# EAGLE design shield puissance (EAGLE 7.5.0)
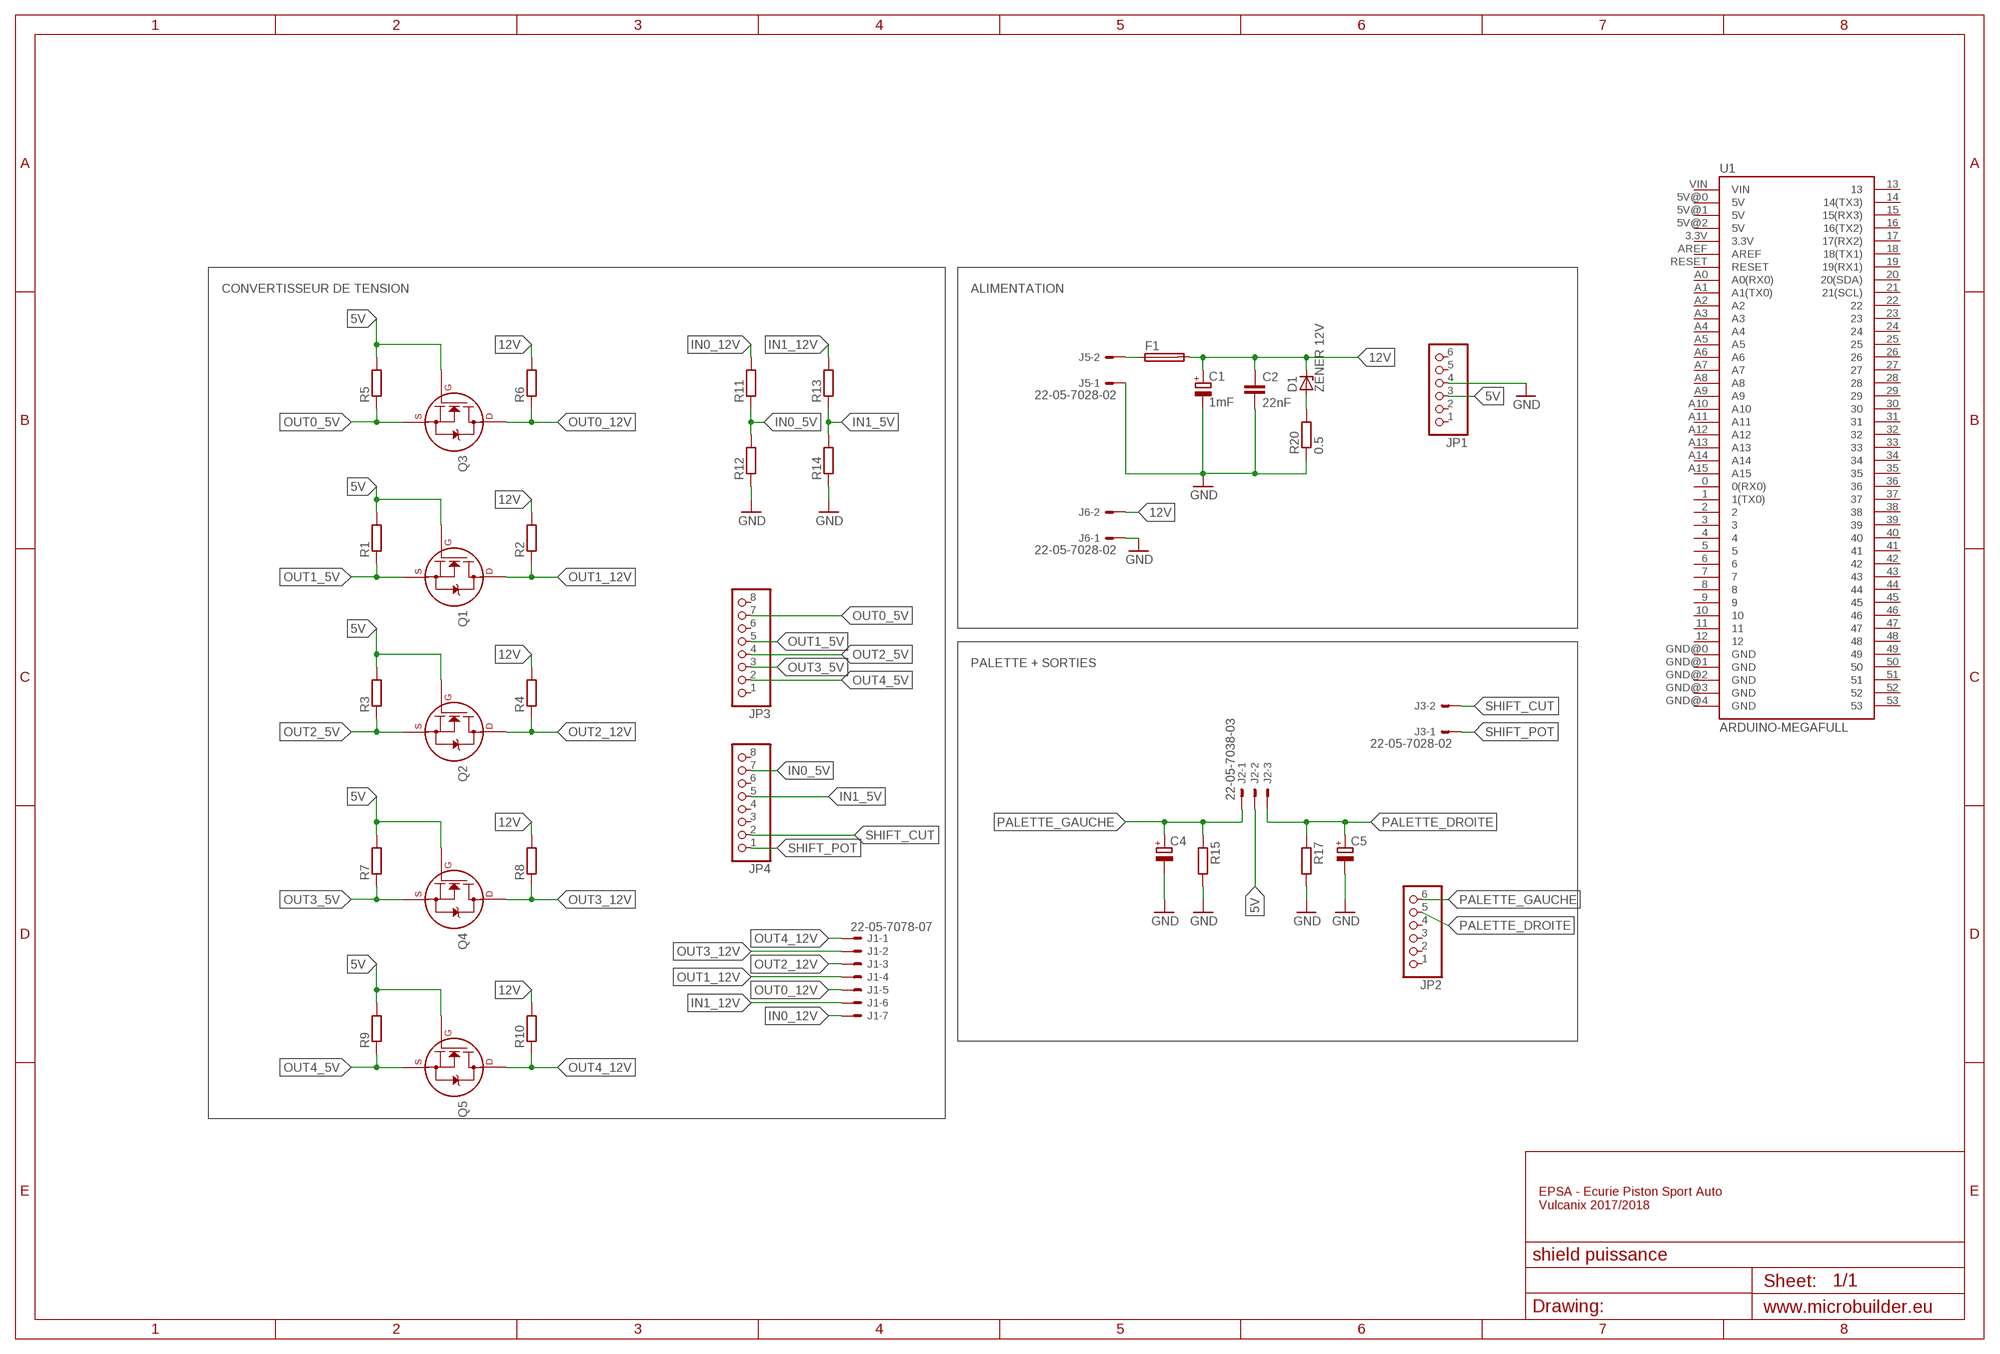
[diagram p0: schematic, sheet 1]

## Parts
C1  1mF  CPOL-EUE2,5-6E  [E2,5-6E]
C2  22nF  C-EU025-025X050  [C025-025X050]
C4  CPOL-EUE2,5-6E  [E2,5-6E]
C5  CPOL-EUE2,5-6E  [E2,5-6E]
D1  ZENER 12V  ZENER-DIODEDO41Z10  [DO41Z10]
F1  SH25  [SH25]
J1  22-05-7078-07  [7395-07]
J2  22-05-7038-03  [7395-03]
J3  22-05-7028-02  [7395-02]
J5  22-05-7028-02  [7395-02]
J6  22-05-7028-02  [7395-02]
JP1  HEADER-1X6  [1X06_OVAL]
JP2  HEADER-1X6  [1X06_OVAL]
JP3  HEADER-1X8  [1X08_OVAL]
JP4  HEADER-1X8  [1X08_OVAL]
Q1  2N7000_TO92  [TO-92]
Q2  2N7000_TO92  [TO-92]
Q3  2N7000_TO92  [TO-92]
Q4  2N7000_TO92  [TO-92]
Q5  2N7000_TO92  [TO-92]
R1  R-EU_0204/7  [0204/7]
R2  R-EU_0204/7  [0204/7]
R3  R-EU_0204/7  [0204/7]
R4  R-EU_0204/7  [0204/7]
R5  R-EU_0204/7  [0204/7]
R6  R-EU_0204/7  [0204/7]
R7  R-EU_0204/7  [0204/7]
R8  R-EU_0204/7  [0204/7]
R9  R-EU_0204/7  [0204/7]
R10  R-EU_0204/7  [0204/7]
R11  R-EU_0204/7  [0204/7]
R12  R-EU_0204/7  [0204/7]
R13  R-EU_0204/7  [0204/7]
R14  R-EU_0204/7  [0204/7]
R15  R-EU_0204/7  [0204/7]
R17  R-EU_0204/7  [0204/7]
R20  0.5  R-EU_0309/12  [0309/12]
U1  ARDUINO-MEGAFULL  [ARDUINO_MEGA]

## Nets
5V: J2.2 JP1.3 Q1.2(G) Q2.2(G) Q3.2(G) Q4.2(G) Q5.2(G) R1.2 R3.2 R5.2 R7.2 R9.2
12V: C1.+ C2.1 D1.C F1.2 J6.2 R2.2 R4.2 R6.2 R8.2 R10.2
GND: C1.- C2.2 C4.- C5.- J5.1 J6.1 JP1.4 R12.1 R14.1 R15.2 R17.2 R20.1
IN0_5V: JP4.7 R11.1 R12.2
IN0_12V: J1.7 R11.2
IN1_5V: JP4.5 R13.1 R14.2
IN1_12V: J1.6 R13.2
N$1: F1.1 J5.2
N$4: D1.A R20.2
OUT0_5V: JP3.7 Q3.1(S) R5.1
OUT0_12V: J1.5 Q3.3(D) R6.1
OUT1_5V: JP3.5 Q1.1(S) R1.1
OUT1_12V: J1.4 Q1.3(D) R2.1
OUT2_5V: JP3.4 Q2.1(S) R3.1
OUT2_12V: J1.3 Q2.3(D) R4.1
OUT3_5V: JP3.3 Q4.1(S) R7.1
OUT3_12V: J1.2 Q4.3(D) R8.1
OUT4_5V: JP3.2 Q5.1(S) R9.1
OUT4_12V: J1.1 Q5.3(D) R10.1
PALETTE_DROITE: C5.+ J2.3 JP2.5 R17.1
PALETTE_GAUCHE: C4.+ J2.1 JP2.6 R15.1
SHIFT_CUT: J3.2 JP4.2
SHIFT_POT: J3.1 JP4.1
Unconnected: JP1.1 JP1.2 JP1.5 JP1.6 JP2.1 JP2.2 JP2.3 JP2.4 JP3.1 JP3.6 JP3.8 JP4.3 JP4.4 JP4.6 JP4.8 U1.0(0(RX0)) U1.1(1(TX0)) U1.2 U1.3 U1.3.3V U1.4 U1.5 U1.5V@0(5V) U1.5V@1(5V) U1.5V@2(5V) U1.6 U1.7 U1.8 U1.9 U1.10 U1.11 U1.12 U1.13 U1.14(14(TX3)) U1.15(15(RX3)) U1.16(16(TX2)) U1.17(17(RX2)) U1.18(18(TX1)) U1.19(19(RX1)) U1.20(20(SDA)) U1.21(21(SCL)) U1.22 U1.23 U1.24 U1.25 U1.26 U1.27 U1.28 U1.29 U1.30 U1.31 U1.32 U1.33 U1.34 U1.35 U1.36 U1.37 U1.38 U1.39 U1.40 U1.41 U1.42 U1.43 U1.44 U1.45 U1.46 U1.47 U1.48 U1.49 U1.50 U1.51 U1.52 U1.53 U1.A0(A0(RX0)) U1.A1(A1(TX0)) U1.A2 U1.A3 U1.A4 U1.A5 U1.A6 U1.A7 U1.A8 U1.A9 U1.A10 U1.A11 U1.A12 U1.A13 U1.A14 U1.A15 U1.AREF U1.GND@0(GND) U1.GND@1(GND) U1.GND@2(GND) U1.GND@3(GND) U1.GND@4(GND) U1.RESET U1.VIN

## Notes on the sheet
- CONVERTISSEUR DE TENSION | ALIMENTATION
- PALETTE + SORTIES
- EPSA - Ecurie Piston Sport Auto
  Vulcanix 2017/2018

## Library data of the parts
C1 C4 C5 = rcl:CPOL-EU: POLARIZED CAPACITOR, European symbol
C2 = rcl:C-EU: CAPACITOR, European symbol
D1 = diode:ZENER-DIODE: Z-Diode
F1 = fuse:SH25: FUSE HOLDER grid 25 mm, OGN0031 8211, Schurter (Buerklin); MF: SCHURTER; MPN: 0031.8211; OC_FARNELL: 1162741; OC_NEWARK: 96B9380
J1 = EP_molex_6410_7395:22-?-07: CONNECTOR wire to board 2.54 mm (.1 inch) pitch header
J2 = EP_molex_6410_7395:22-?-03: CONNECTOR wire to board 2.54 mm (.1 inch) pitch header
J3 J5 J6 = EP_molex_6410_7395:22-?-02: CONNECTOR wire to board 2.54 mm (.1 inch) pitch header
JP1 JP2 = microbuilder:HEADER-1X6: PIN HEADER
JP3 JP4 = microbuilder:HEADER-1X8: PIN HEADER
Q1-Q5 = transistors:2N700*: 2N7000, 2N7002, NDS7002A N-channel enhancement mode MOSFET
R1-R15 R17 R20 = resistor:R-EU_: RESISTOR, European symbol
U1 = SparkFun-Boards:ARDUINO-MEGA: Arduino Mega board footprint

## Board
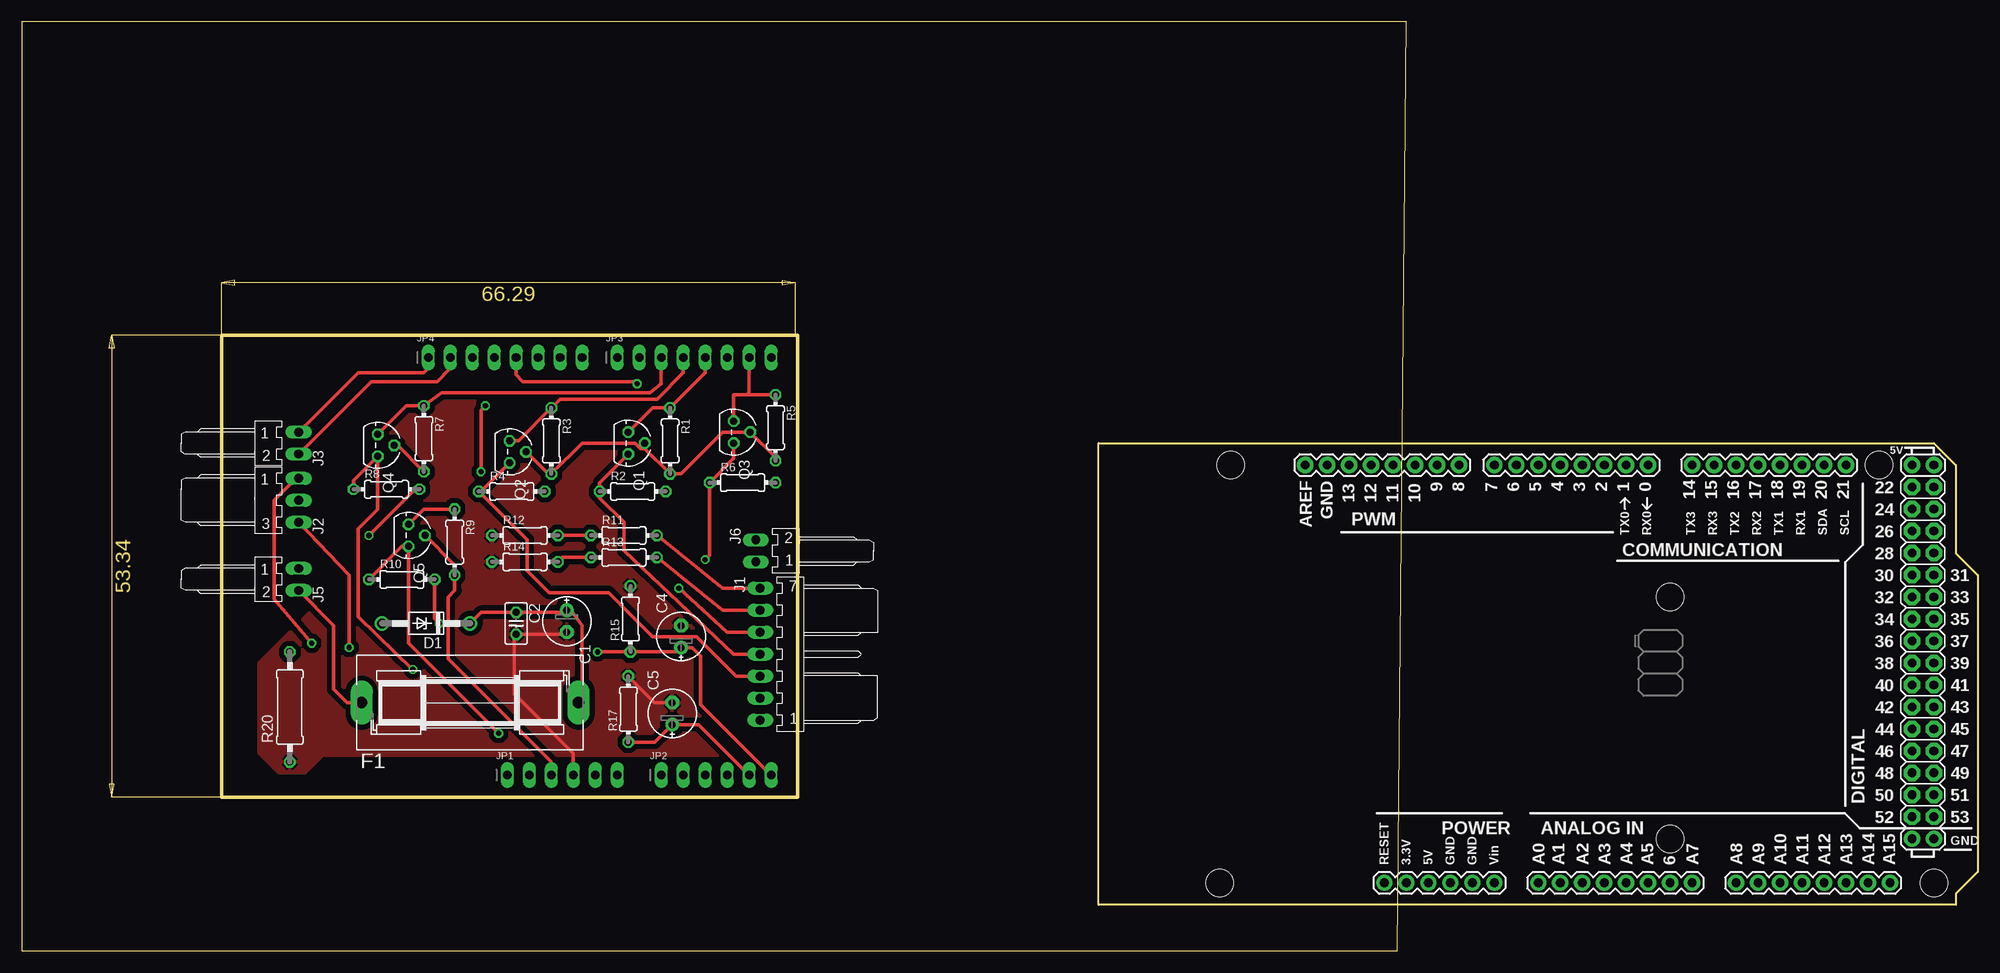
[diagram p1: board, top side]
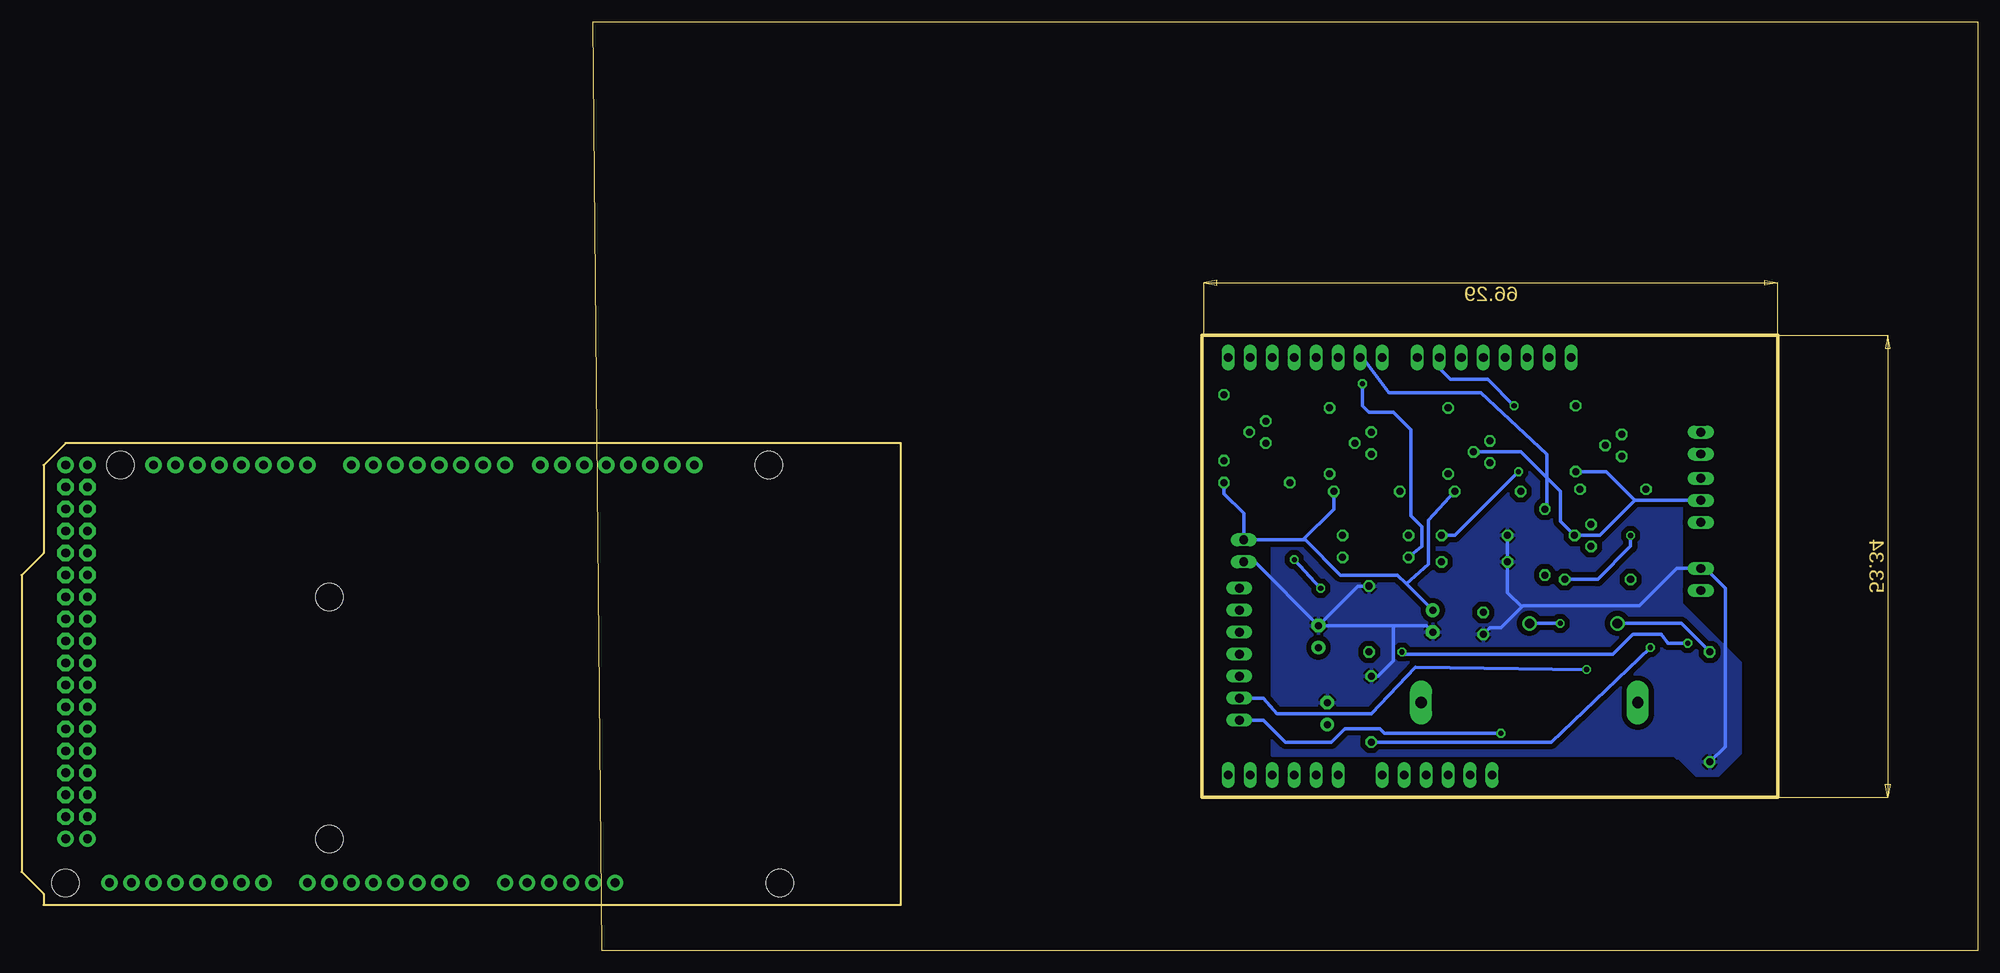
[diagram p2: board, bottom side, seen from below]

Size 160 x 107.37 mm. Coordinates in mm from the lower left corner, seen from the top.
Outline: 0,0 158.98,0 160,107.37 0,107.37 0,0
Outline: 23.11,71.12 23.11,17.78 89.66,17.78 89.66,71.12 23.11,71.12
Copper layers (1*16): Top 0.035mm / dielectric 1.5mm / Bottom 0.035mm
Design rules "default *": minimum track width 10mil, minimum drill 24mil, track to track 10mil, track to pad 10mil, pad to pad 10mil, via to via 10mil, smd to smd 8mil, copper to edge 40mil, drill to drill 8mil, minimum pad ring 10mil, minimum via ring 8mil, stop-mask expansion 4mil, vias tented up to drill 0mil, thermal gap 10mil

### Footprints (pad centres in the part's own frame; a part is rotated, then mirrored left to right if it is on the bottom)
E2,5-6E = drill 0.813 pad 1.575: + -1.27,0 | drill 0.813 pad 1.575 octagon: - 1.27,0
C025-025X050 = drill 0.813 octagon: 1 -1.27,0; 2 1.27,0
DO41Z10 = drill 1.118: A 5.08,0; C -5.08,0
SH25 = drill 1.321 pad 2.54 long: 1 -12.522,0; 2 12.522,0
7395-07 = drill 1.016 long: 1 7.62,0; 2 5.08,0; 3 2.54,0; 4 0,0; 5 -2.54,0; 6 -5.08,0; 7 -7.62,0
7395-03 = drill 1.016 long: 1 2.54,0; 2 0,0; 3 -2.54,0
7395-02 = drill 1.016 long: 1 1.27,0; 2 -1.27,0
1X06_OVAL = drill 1 long: 1 -6.35,0; 2 -3.81,0; 3 -1.27,0; 4 1.27,0; 5 3.81,0; 6 6.35,0
1X08_OVAL = drill 1 long: 1 -8.89,0; 2 -6.35,0; 3 -3.81,0; 4 -1.27,0; 5 1.27,0; 6 3.81,0; 7 6.35,0; 8 8.89,0
TO-92 = drill 0.813 octagon: 1 -1.27,0; 2 0,1.905; 3 1.27,0
0204/7 = drill 0.813 octagon: 1 -3.81,0; 2 3.81,0
0309/12 = drill 0.813 octagon: 1 -6.35,0; 2 6.35,0
ARDUINO_MEGA = drill 1.016 pad 1.88: 0 63.5,50.8; 1 60.96,50.8; 2 58.42,50.8; 3 55.88,50.8; 3.3V 35.56,2.54; 4 53.34,50.8; 5 50.8,50.8; 5V@0 38.1,2.54; 5V@1 93.98,50.8; 5V@2 96.52,50.8; 6 48.26,50.8; 7 45.72,50.8; 8 41.656,50.8; 9 39.116,50.8; 10 36.576,50.8; 11 34.036,50.8; 12 31.496,50.8; 13 28.956,50.8; 14 68.58,50.8; 15 71.12,50.8; 16 73.66,50.8; 17 76.2,50.8; 18 78.74,50.8; 19 81.28,50.8; 20 83.82,50.8; 21 86.36,50.8; A0 50.8,2.54; A1 53.34,2.54; A2 55.88,2.54; A3 58.42,2.54; A4 60.96,2.54; A5 63.5,2.54; A6 66.04,2.54; A7 68.58,2.54; A8 73.66,2.54; A9 76.2,2.54; A10 78.74,2.54; A11 81.28,2.54; A12 83.82,2.54; A13 86.36,2.54; A14 88.9,2.54; A15 91.44,2.54; AREF 23.876,50.8; GND@0 40.64,2.54; GND@1 43.18,2.54; GND@2 93.98,7.62; GND@3 96.52,7.62; GND@4 26.416,50.8; RESET 33.02,2.54; VIN 45.72,2.54 | drill 1.016 pad 1.88 octagon: 22 93.98,48.26; 23 96.52,48.26; 24 93.98,45.72; 25 96.52,45.72; 26 93.98,43.18; 27 96.52,43.18; 28 93.98,40.64; 29 96.52,40.64; 30 93.98,38.1; 31 96.52,38.1; 32 93.98,35.56; 33 96.52,35.56; 34 93.98,33.02; 35 96.52,33.02; 36 93.98,30.48; 37 96.52,30.48; 38 93.98,27.94; 39 96.52,27.94; 40 93.98,25.4; 41 96.52,25.4; 42 93.98,22.86; 43 96.52,22.86; 44 93.98,20.32; 45 96.52,20.32; 46 93.98,17.78; 47 96.52,17.78; 48 93.98,15.24; 49 96.52,15.24; 50 93.98,12.7; 51 96.52,12.7; 52 93.98,10.16; 53 96.52,10.16 | hole 3.2: 15.24,50.8; 13.97,2.54; 66.04,35.56; 66.04,7.62; 90.17,50.8; 96.52,2.54

### Placement (x,y rotation side)
C1  62.99,38.1 270 top
C2  57.15,37.85 270 top
C4  76.2,36.32 90 top
C5  75.18,27.43 90 top
D1  46.74,37.85 180 top
F1  51.82,28.7 0 top
J1  85.34,34.29 270 top
J2  32,52.07 90 top
J3  32,58.67 90 top
J5  32,42.93 90 top
J6  84.84,46.23 270 top
JP1  62.48,20.32 0 top
JP2  80.26,20.32 0 top
JP3  77.72,68.58 0 top
JP4  55.88,68.58 0 top
Q1  70.1,58.67 270 top
Q2  56.39,57.66 270 top
Q3  82.3,59.94 270 top
Q4  41.15,58.42 270 top
Q5  44.7,48.01 270 top
R1  74.93,58.93 270 top
R2  70.61,53.09 0 top
R3  61.21,58.93 270 top
R4  56.64,53.09 0 top
R5  87.12,60.45 270 top
R6  83.31,54.1 0 top
R7  46.48,59.18 270 top
R8  42.16,53.34 0 top
R9  50.04,47.24 270 top
R10  43.94,42.93 0 top
R11  69.6,48.01 0 top
R12  58.17,48.01 0 top
R13  69.6,45.47 0 top
R14  58.17,44.96 0 top
R15  70.36,38.35 90 top
R17  70.1,27.94 90 top
R20  30.99,28.19 90 top
U1  124.46,5.33 0 top

### Tracks (layer width: path | path; a pad name or v marks a point on that pad's centre or on a via)
5V
  Top 0.406: R7.2 43.43,58.42 Q4.2 | Q2.2 60.83,55.12 R3.2 64.77,58.67 70.87,58.67 71.5,58.04 72.01,58.04 | 72.01,58.04 R1.2 76.2,55.12 81.03,59.94 Q3.2 87.12,57.02 R5.2 | 72.01,58.04 Q1.2 | Q5.2 50.04,44.58 R9.2 50.04,41.66 49.28,40.89 49.28,33.78 61.21,21.84 JP1.3
  Bottom 0.406: J2.2 39.62,52.07 | 39.62,52.07 43.69,48.01 Q5.2 48.26,49.66 48.26,53.09 52.83,57.66 Q2.2 | 39.62,52.07 42.93,55.37 R7.2
12V  (via drill 0.6)
  Top 0.406: F1.2 64.77,29.64 64.77,37.59 63.5,39.37 C1.+ 62.74,39.12 C2.1 53.09,39.12 D1.C | R10.2 47.75,38.35 v48.26,37.85 | R8.2 45.47,53.34 v40.13,48.01
  Bottom 0.406: 77.98,47.5 J6.2 84.84,50.55 87.12,52.83 R6.2 | 77.98,47.5 77.72,47.5 73.66,43.43 67.06,43.43 66.04,42.42 | 66.04,42.42 C1.+ | v48.26,37.85 D1.C | R4.2 63.5,49.78 63.5,44.7 66.04,42.42 | R2.2 74.42,51.05 77.98,47.5 | v40.13,48.01 40.13,46.74 43.94,42.93 R10.2
GND
  Top 0.406: JP1.4 63.75,22.86 56.9,29.72 56.9,36.32 C2.2 62.74,36.58 C1.- | C5.- 73.15,28.7 R17.2
  Bottom 0.406: R20.1 29.21,23.62 29.21,41.91 31.5,44.2 J5.1 34.8,44.2 39.12,39.88 52.58,39.88 52.7,39.75 | 52.7,39.75 55.12,37.34 56.39,37.34 C2.2 | 52.7,39.75 54.36,41.4 R14.1 R12.1 | R15.2 71.63,42.16 C4.- | C4.- 67.56,37.59 | 67.56,37.59 63.75,37.59 C1.- | J6.1 83.57,44.96 C4.- | R17.2 69.34,31.75 67.56,33.53 67.56,37.59
  pour Top (isolate 0.61): 31.5,61.47 36.58,66.55 87.38,66.55 88.39,65.53 88.39,52.58 85.09,49.28 83.57,49.28 81.79,47.5 81.79,22.61 34.8,22.61 32.77,20.57 29.72,20.57 27.43,22.86 27.43,33.27 34.29,40.13 34.29,60.71 33.53,61.47
  pour Bottom (isolate 0.61): 36.58,66.55 87.38,66.55 88.39,65.53 88.39,52.58 85.09,49.28 83.31,49.28 81.53,47.5 81.53,22.61 35.05,22.61 34.8,22.35 34.54,22.35 32.51,20.32 29.97,20.32 27.43,22.86 27.43,33.27 34.29,40.13 34.29,60.45 34.54,60.71 34.29,60.71 33.53,61.47 33.53,63.5
IN0_5V  (via drill 0.6)
  Top 0.406: R11.1 R12.2 | v53.09,55.37 53.09,62.48 v53.59,62.99
  Bottom 0.406: R12.2 60.45,48.01 v53.09,55.37 | v53.59,62.99 56.64,66.04 60.96,66.04 62.23,67.31 JP4.7
IN0_12V
  Top 0.406: R11.2 81.03,41.91 J1.7
IN1_5V  (via drill 0.6)
  Top 0.406: R14.2 62.48,45.47 R13.1 | JP4.5 57.15,66.55 57.91,65.79 70.87,65.79 v71.12,65.53
  Bottom 0.406: v71.12,65.53 71.12,62.99 70.36,62.23 67.56,62.23 65.53,60.2 65.53,50.29 64.26,49.02 64.26,46.74 R13.1
IN1_12V
  Top 0.406: J1.6 81.03,39.37 R13.2
N$1
  Top 0.406: J5.2 36.07,37.59 36.07,30.23 37.59,28.7 F1.1
N$4
  Bottom 0.406: D1.A 34.29,37.85 R20.2
OUT0_5V
  Top 0.406: Q3.1 82.3,64.26 83.82,64.26 | 83.82,64.26 R5.1 | JP3.7 84.07,64.52 83.82,64.26
OUT0_12V  (via drill 0.6)
  Top 0.406: Q3.3 82.3,56.9 R6.1 79.5,45.72 v78.99,45.21 | v75.95,41.91 81.53,36.83 J1.5
  Bottom 0.406: v78.99,45.21 v75.95,41.91
OUT1_5V
  Top 0.406: Q1.1 72.9,62.74 R1.1 78.99,66.8 JP3.5
OUT1_12V
  Top 0.406: Q1.3 66.8,54.1 R2.1 66.8,52.32 69.6,49.53 69.6,46.23 82.3,34.29 J1.4
OUT2_5V
  Top 0.406: Q2.1 57.4,58.93 R3.1 62.23,63.75 73.41,63.75 76.45,66.8 JP3.4
OUT2_12V
  Top 0.406: Q2.3 53.09,53.09 R4.1 58.42,47.5 58.42,43.94 60.96,41.4 67.82,41.4 72.9,36.32 77.98,36.32 82.55,31.75 J1.3
OUT3_5V
  Top 0.406: Q4.1 44.45,62.99 R7.1 48.51,64.52 72.64,64.52 73.91,65.53 JP3.3
OUT3_12V  (via drill 0.6)
  Top 0.406: R8.1 38.35,54.36 Q4.3 41.15,51.05 38.86,48.77 38.86,38.61 v45.21,32.51
  Bottom 0.406: v45.21,32.51 65.02,32.77 70.1,27.43 81.03,27.43 82.55,29.21 J1.2
OUT4_5V
  Top 0.406: R9.1 46.48,51.05 Q5.1
  Bottom 0.406: JP3.2 71.12,68.58 68.07,64.52 57.4,64.52 49.78,57.4 49.78,51.31 R9.1
OUT4_12V  (via drill 0.6)
  Top 0.406: R10.1 43.94,46.74 Q5.3 44.7,35.56 v55.12,25.15
  Bottom 0.406: v55.12,25.15 68.58,25.15 69.09,25.65 73.15,25.65 74.68,24.13 80.01,24.13 82.55,26.67 J1.1
PALETTE_DROITE  (via drill 0.6)
  Top 0.406: JP2.5 78.23,26.16 C5.+ 73.15,24.13 R17.1 | v37.85,35.05 37.85,43.43 J2.3
  Bottom 0.406: R17.1 49.28,24.13 v37.85,35.05
PALETTE_GAUCHE  (via drill 0.6)
  Top 0.406: JP2.6 78.49,28.45 78.49,34.04 77.47,35.05 C4.+ 75.69,34.54 R15.1 v66.55,34.54 | J2.1 31.75,54.61 29.21,52.07 29.21,40.64 v33.53,35.56
  Bottom 0.406: v33.53,35.56 35.81,35.56 36.58,36.58 39.88,36.58 42.16,34.29 66.29,34.29 v66.55,34.54
SHIFT_CUT
  Top 0.406: J3.2 40.39,65.79 48.01,65.79 49.53,67.31 JP4.2
SHIFT_POT
  Top 0.406: J3.1 38.86,66.8 46.48,66.8 46.99,67.31 JP4.1